# Altium schematic sheet [03] SOC.SchDoc: SOC
size A3; Organization: Blinkinlabs, LLC; DocumentNumber: 3; SheetNumber: 3; SheetTotal: 4
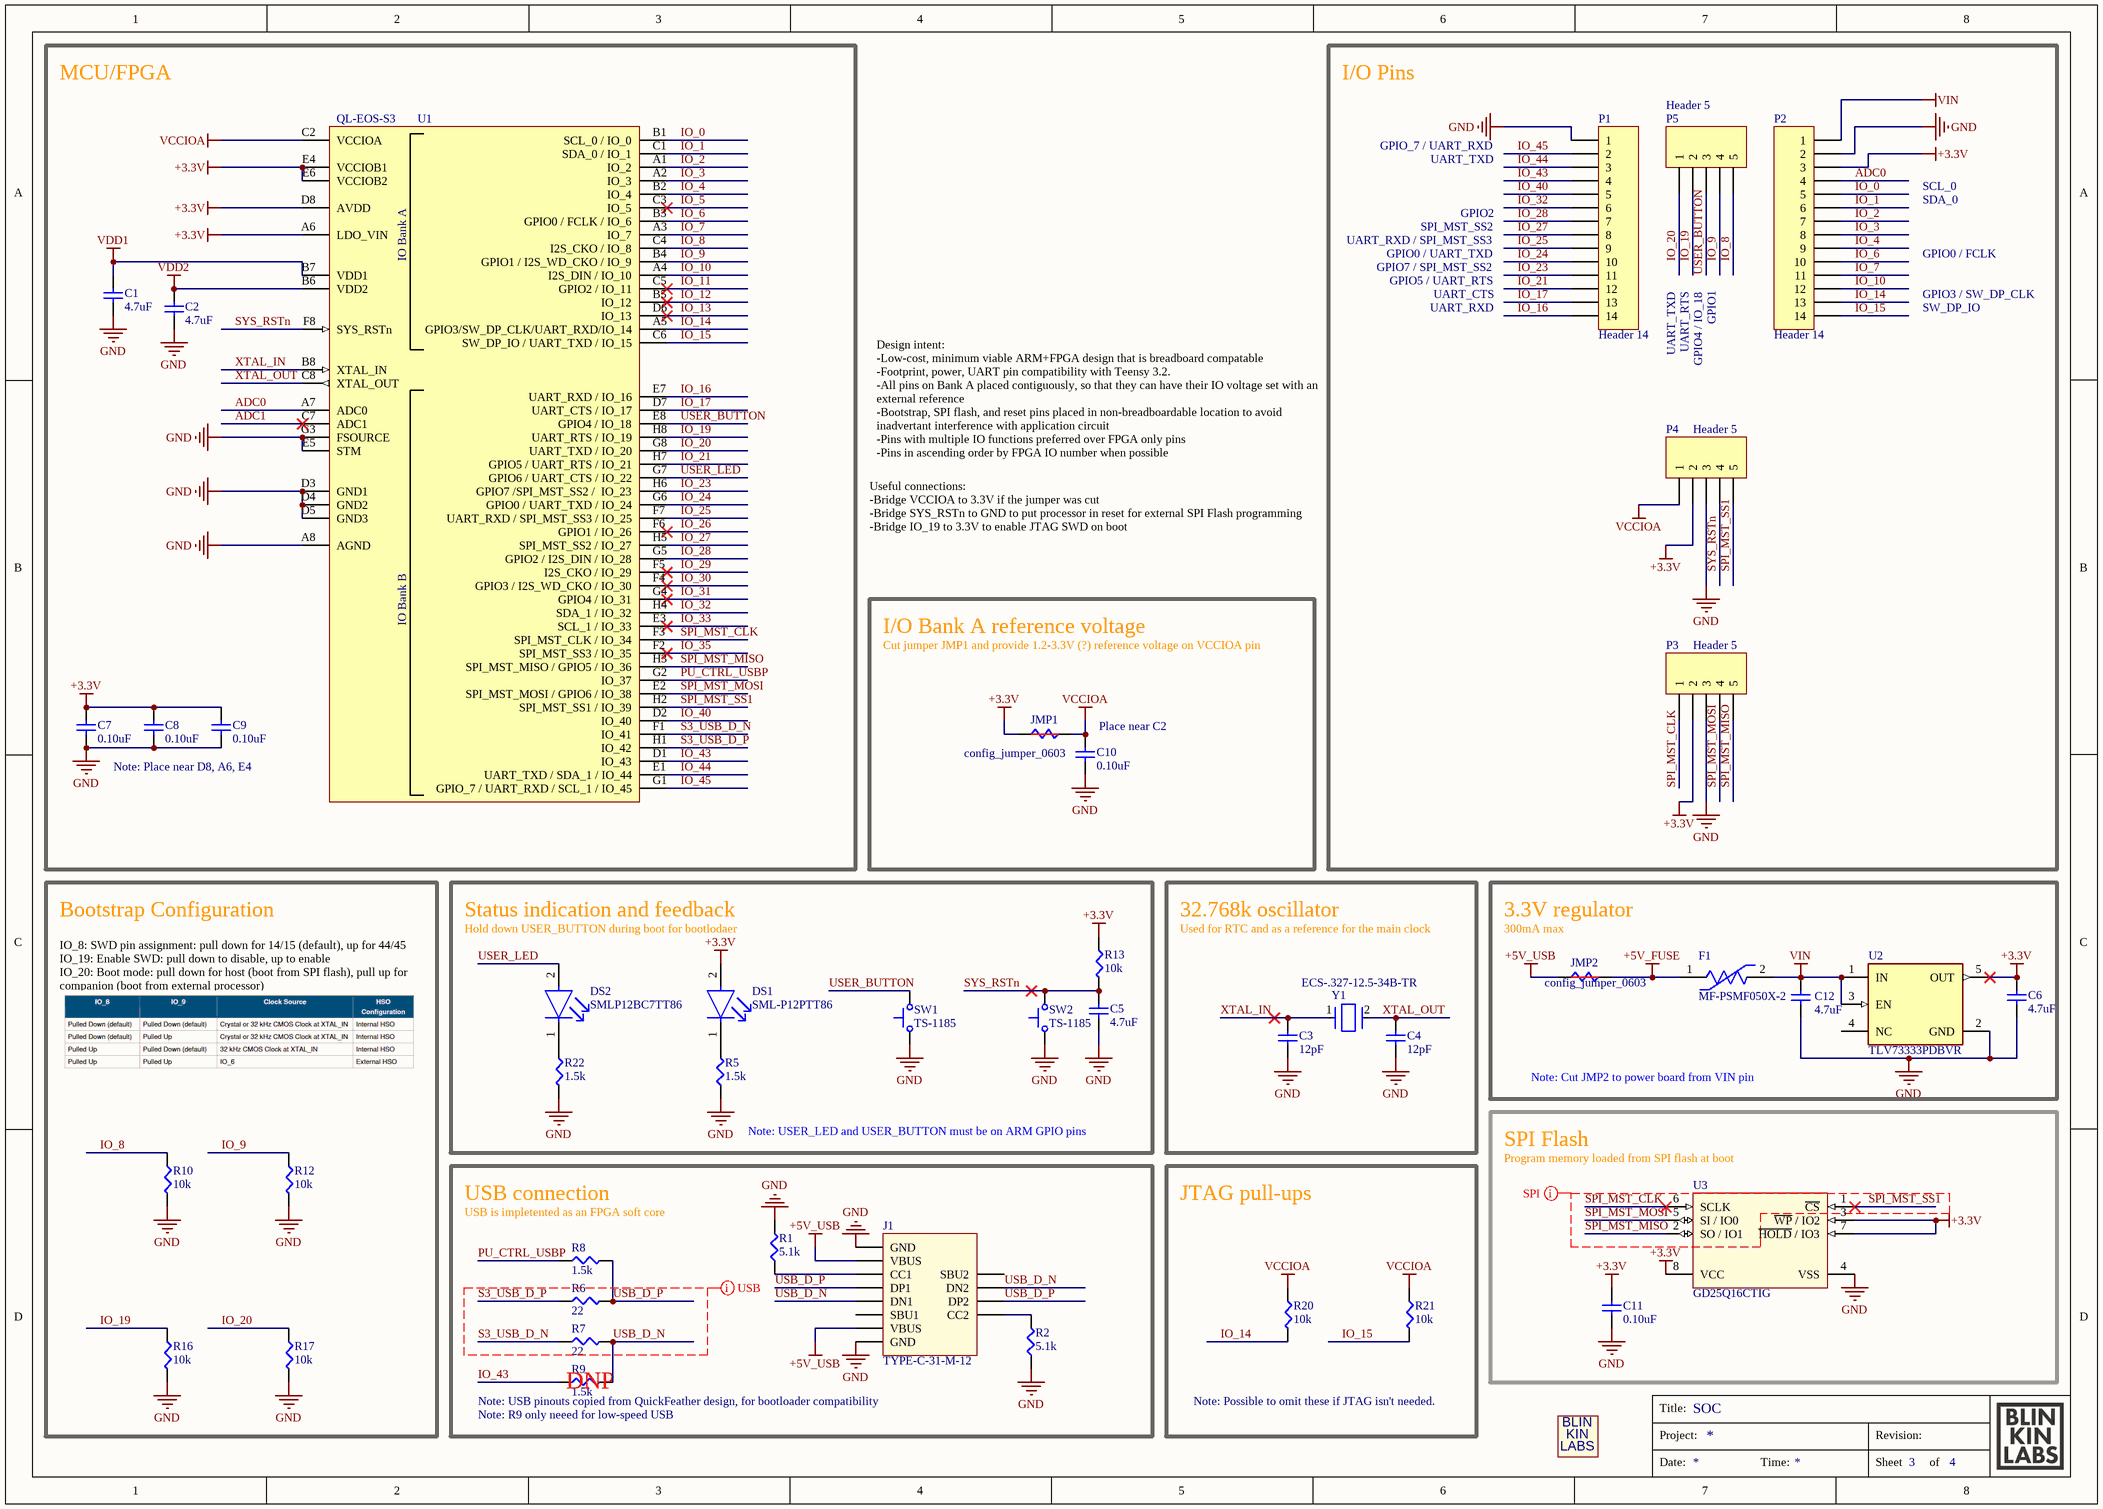
[diagram p0: [03] SOC.SchDoc]

## Parts
C1  4.7uF  [CAPC1005X06L]
C2  4.7uF  [CAPC1005X06L]
C3  12pF  [CAPC1005X06L]
C4  12pF  [CAPC1005X06L]
C5  4.7uF  [CAPC1005X06L]
C6  4.7uF  [CAPC1005X06L]
C7  0.10uF  [CAPC1005X06L]
C8  0.10uF  [CAPC1005X06L]
C9  0.10uF  [CAPC1005X06L]
C10  0.10uF  [CAPC1005X06L]
C11  0.10uF  [CAPC1005X06L]
C12  4.7uF  [CAPC1608X09L]
DS1  SML-P12PTT86  [FP-SML-P1-MFG]
DS2  SMLP12BC7TT86  [FP-SML-P12-MFG]
F1  MF-PSMF050X-2  [FP-MF-PSMF-MFG]
J1  TYPE-C-31-M-12  [TYPE-C-31-M-12]
JMP1  config_jumper_0603  [config_jumper_0603]  (no BOM)
JMP2  config_jumper_0603  [config_jumper_0603]  (no BOM)
L?  BLINKINLABS_LOGO  [BLINKINLABS_LOGO_SMALL]  (value not drawn)  (no BOM)
P1  Header 14  [HDR1X14]
P2  Header 14  [HDR1X14]
P3  Header 5  [HDR1X5]
P4  Header 5  [HDR1X5]
P5  Header 5  [HDR1X5]
R1  5.1k  [ERJ2G(0402)_L]
R2  5.1k  [ERJ2G(0402)_L]
R5  1.5k  [ERJ2G(0402)_L]
R6  22  [ERJ2G(0402)_L]
R7  22  [ERJ2G(0402)_L]
R8  1.5k  [ERJ2G(0402)_L]
R9  1.5k  [ERJ2G(0402)_L]
R10  10k  [ERJ2G(0402)_L]
R12  10k  [ERJ2G(0402)_L]
R13  10k  [ERJ2G(0402)_L]
R16  10k  [ERJ2G(0402)_L]
R17  10k  [ERJ2G(0402)_L]
R20  10k  [ERJ2G(0402)_L]
R21  10k  [ERJ2G(0402)_L]
R22  1.5k  [ERJ2G(0402)_L]
SW1  TS-1185  [TS-1185]
SW2  TS-1185  [TS-1185]
U1  QL-EOS-S3  [BGA64C40P8X8_350X350X80]
U2  TLV73333PDBVR  [FP-DBV0005A-MFG]
U3  GD25Q16CTIG  [SOP127P600X175-8N-2]
Y1  ECS-.327-12.5-34B-TR  [FP-ECX-31B-MFG]

## Blocks framed on the sheet
MCU/FPGA: C1 C2 C7-C9 U1
I/O Pins: P1-P5
I/O Bank A reference voltage: C10 JMP1
Bootstrap Configuration: R10 R12 R16 R17
Status indication and feedback: C5 DS1 DS2 R5 R13 R22 SW1 SW2
32.768k oscillator: C3 C4 Y1
3.3V regulator: C6 C12 F1 JMP2 U2
SPI Flash: C11 U3
DNP: J1 R1 R2 R6-R9
JTAG pull-ups: R20 R21

## Nets
+3.3V: C6.1 C7.2 C8.2 C9.2 C11.2 DS1.2(A) JMP1.1 P2.3 P3.2 P4.2 R13.1 U1.A6(LDO_VIN) U1.D8(AVDD) U1.E4(VCCIOB1) U1.E6(VCCIOB2) U2.5(OUT) U3.3(~{WP}_/_IO2) U3.7(~{HOLD}_/_IO3) U3.8(VCC)
+5V_FUSE: F1.1 JMP2.2
+5V_USB: J1.A4/B9(VBUS) J1.A9/B4(VBUS) JMP2.1
GND: C1.2 C2.2 C3.1 C4.1 C5.2 C6.2 C7.1 C8.1 C9.1 C10.1 C11.1 C12.2 J1.A1/B12(GND) J1.A12/B1(GND) P1.1 P2.2 P3.3 P4.3 R1.2 R2.1 R5.1 R10.2 R12.2 R16.2 R17.2 R22.2 SW1.1 SW2.1 U1.A8(AGND) U1.D3(GND1) U1.D4(GND2) U1.D5(GND3) U1.E5(STM) U1.G3(FSOURCE) U2.2(GND) U3.4(VSS)
VCCIOA: C10.2 JMP1.2 P4.1 R20.1 R21.1 U1.C2(VCCIOA)
VDD1: C1.1 U1.B7(VDD1)
VDD2: C2.1 U1.B6(VDD2)
VIN: C12.1 F1.2 P2.1 U2.1(IN) U2.3(EN)
ADC0: P2.4 U1.A7(ADC0)
ADC1: U1.C7(ADC1)
IO_0: P2.5 U1.B1(SCL_0_/_IO_0)
IO_1: P2.6 U1.C1(SDA_0_/_IO_1)
IO_2: P2.7 U1.A1(IO_2)
IO_3: P2.8 U1.A2(IO_3)
IO_4: P2.9 U1.B2(IO_4)
IO_5: U1.C3(IO_5)
IO_6: P2.10 U1.B3(GPIO0_/_FCLK_/_IO_6)
IO_7: P2.11 U1.A3(IO_7)
IO_8: P5.5 R10.1 U1.C4(I2S_CKO_/_IO_8)
IO_9: P5.4 R12.1 U1.B4(GPIO1_/_I2S_WD_CKO_/_IO_9)
IO_10: P2.12 U1.A4(I2S_DIN_/_IO_10)
IO_11: U1.C5(GPIO2_/_IO_11)
IO_12: U1.B5(IO_12)
IO_13: U1.D6(IO_13)
IO_14: P2.13 R20.2 U1.A5(GPIO3/SW_DP_CLK/UART_RXD/IO_14)
IO_15: P2.14 R21.2 U1.C6(SW_DP_IO_/_UART_TXD_/_IO_15)
IO_16: P1.14 U1.E7(UART_RXD_/_IO_16)
IO_17: P1.13 U1.D7(UART_CTS_/_IO_17)
IO_19: P5.2 R16.1 U1.H8(UART_RTS_/_IO_19)
IO_20: P5.1 R17.1 U1.G8(UART_TXD_/_IO_20)
IO_21: P1.12 U1.H7(GPIO5_/_UART_RTS_/_IO_21)
IO_23: P1.11 U1.H6(GPIO7_/SPI_MST_SS2_/__IO_23)
IO_24: P1.10 U1.G6(GPIO0_/_UART_TXD_/_IO_24)
IO_25: P1.9 U1.F7(UART_RXD_/_SPI_MST_SS3_/_IO_25)
IO_26: U1.F6(GPIO1_/_IO_26)
IO_27: P1.8 U1.H5(SPI_MST_SS2_/_IO_27)
IO_28: P1.7 U1.G5(GPIO2_/_I2S_DIN_/_IO_28)
IO_29: U1.F5(I2S_CKO_/_IO_29)
IO_30: U1.F4(GPIO3_/_I2S_WD_CKO_/_IO_30)
IO_31: U1.G4(GPIO4_/_IO_31)
IO_32: P1.6 U1.H4(SDA_1_/_IO_32)
IO_33: U1.E3(SCL_1_/_IO_33)
IO_35: U1.F2(SPI_MST_SS3_/_IO_35)
IO_40: P1.5 U1.D2(IO_40)
IO_43: P1.4 R9.1 U1.D1(IO_43)
IO_44: P1.3 U1.E1(UART_TXD_/_SDA_1_/_IO_44)
IO_45: P1.2 U1.G1(GPIO_7_/_UART_RXD_/_SCL_1_/_IO_45)
PU_CTRL_USBP: R8.1 U1.G2(IO_37)
S3_USB_D_N: R7.1 U1.F1(IO_41)
S3_USB_D_P: R6.1 U1.H1(IO_42)
SPI_MST_CLK: P3.1 U1.F3(SPI_MST_CLK_/_IO_34) U3.6(SCLK)
SPI_MST_MISO: P3.5 U1.H3(SPI_MST_MISO_/_GPIO5_/_IO_36) U3.2(SO_/_IO1)
SPI_MST_MOSI: P3.4 U1.E2(SPI_MST_MOSI_/_GPIO6_/_IO_38) U3.5(SI_/_IO0)
SPI_MST_SS1: P4.5 U1.H2(SPI_MST_SS1_/_IO_39) U3.1(~{CS})
SYS_RSTn: C5.1 P4.4 R13.2 SW2.2 U1.F8(SYS_RSTn)
USB_D_N: J1.A7(DN1) J1.B7(DN2) R7.2 R9.2
USB_D_P: J1.A6(DP1) J1.B6(DP2) R6.2 R8.2
USER_BUTTON: P5.3 SW1.2 U1.E8(GPIO4_/_IO_18)
USER_LED: DS2.2(A) U1.G7(GPIO6_/_UART_CTS_/_IO_22)
XTAL_IN: C3.2 U1.B8(XTAL_IN) Y1.1(In/Out)
XTAL_OUT: C4.2 U1.C8(XTAL_OUT) Y1.2(Out/In)
NetDS1_1: DS1.1(C) R5.2
NetDS2_1: DS2.1(C) R22.1
NetJ1_A5: J1.A5(CC1) R1.1
NetJ1_B5: J1.B5(CC2) R2.2

Not connected (* = marked no-connect by the designer): J1 A8(SBU1) B8(SBU2); U2 4(NC)

## Layout directives
net class SPI: SPI_MST_CLK, SPI_MST_MISO, SPI_MST_MOSI, SPI_MST_SS1
net class USB: S3_USB_D_N, S3_USB_D_P, USB_D_N, USB_D_P

## Notes on the sheet
- GPIO_7 / UART_RXD
- UART_TXD
- UART_RXD / SPI_MST_SS3
- SPI_MST_SS2
- GPIO2
- SDA_0
- SCL_0
- GPIO7 / SPI_MST_SS2
- GPIO0 / UART_TXD
- GPIO5 / UART_RTS
- UART_RXD
- UART_CTS
- GPIO0 / FCLK
- GPIO3 / SW_DP_CLK
- SW_DP_IO
- UART_RTS
- GPIO4 / IO_18
- GPIO1
- Design intent:
  -Low-cost, minimum viable ARM+FPGA design that is breadboard compatable
  -Footprint, power, UART pin compatibility with Teensy 3.2.
  -All pins on Bank A placed contiguously, so that they can have their IO voltage set with an external reference
  -Bootstrap, SPI flash, and reset pins placed in non-breadboardable location to avoid inadvertant interference with application circuit
  -Pins with multiple IO functions preferred over FPGA only pins
  -Pins in ascending order by FPGA IO number when possible
- Useful connections:
  -Bridge VCCIOA to 3.3V if the jumper was cut
  -Bridge SYS_RSTn to GND to put processor in reset for external SPI Flash programming
  -Bridge IO_19 to 3.3V to enable JTAG SWD on boot
- Cut jumper JMP1 and provide 1.2-3.3V (?) reference voltage on VCCIOA pin
- Note: Place near D8, A6, E4
- (near C10) Place near C2
- Hold down USER_BUTTON during boot for bootlodaer
- Used for RTC and as a reference for the main clock
- (near JMP2) 300mA max
- IO_8: SWD pin assignment: pull down for 14/15 (default), up for 44/45
  IO_19: Enable SWD: pull down to disable, up to enable
  IO_20: Boot mode: pull down for host (boot from SPI flash), pull up for companion (boot from external processor)
- Note: Cut JMP2 to power board from VIN pin
- (near R5) Note: USER_LED and USER_BUTTON must be on ARM GPIO pins
- (near U3) Program memory loaded from SPI flash at boot
- USB connection
- (near R8) USB is impletented as an FPGA soft core
- (near R9) Note: USB pinouts copied from QuickFeather design, for bootloader compatibility
- (near R9) Note: R9 only neeed for low-speed USB
- Note: Possible to omit these if JTAG isn't needed.
- Title:
- Project:
- Revision:
- Date:
- Time:
- Sheet
- of
- (in symbol BLINKINLABS_LOGO) BLIN; KIN; LABS
- (in symbol QL-EOS-S3) IO Bank A; IO Bank B

## Library data of the parts
C1 C2 C5 C6 = GRM155R60J475ME47D: CAP CER 4.7UF 6.3V X5R 0402; Manufacturer: Murata Electronics North America; Tolerance: ±20%; PartNumber: GRM155R60J475ME47D; Datasheets: http://www.murata.com/~/media/webrenewal/support/library/catalog/products/capacitor/mlcc/c02e.pdf; Image: //media.digikey.com/Renders/Murata%20Renders/ZRB-SERIES-0402.jpg; Digi-Key Part Number: 490-5915-1-ND; Packaging: Cut Tape (CT); Series: GRM; Value: 4.7uF; Voltage: 6.3V; Temperature Coefficient: X5R; Operating Temperature: -55°C ~ 85°C; Features: Derating Recommended; Applications: General Purpose; Package / Case: 0402 (1005 Metric); Case/Package: 0402
C3 C4 = GRM1555C1E120GA01D: CAP CER 12PF 25V NP0 0402; Manufacturer: Murata Electronics North America; Tolerance: ±2%; Temperature Coefficient: C0G, NP0; PartNumber: GRM1555C1E120GA01D; Datasheets: http://www.murata.com/~/media/webrenewal/support/library/catalog/products/capacitor/mlcc/c02e.pdf; Image: //media.digikey.com/Renders/Murata%20Renders/ZRB-SERIES-0402.jpg; Digi-Key Part Number: 490-8169-1-ND; Packaging: Cut Tape (CT); Series: GRM; Value: 12pF; Voltage: 25V; Operating Temperature: -55°C ~ 125°C; Features: -; Applications: General Purpose; Package / Case: 0402 (1005 Metric); Case/Package: 0402
C7-C11 = GRM152R61A104ME19D: CAP CER 0.1UF 10V X5R 0402; Manufacturer: Murata Electronics North America; Tolerance: ±20%; Datasheets: http://www.murata.com/~/media/webrenewal/support/library/catalog/products/capacitor/mlcc/c02e.pdf; Image: //media.digikey.com/Renders/Murata%20Renders/ZRB-SERIES-0402.jpg; Digi-Key Part Number: 490-10009-1-ND; Packaging: Cut Tape (CT); Series: GRM; Value: 0.10uF; Voltage: 10V; Temperature Coefficient: X5R; Operating Temperature: -55°C ~ 85°C; Features: Derating Recommended; Applications: General Purpose; Package / Case: 0402 (1005 Metric); Case/Package: 0402; PartNumber: GRM152R61A104ME19D
C12 = GRM188R61A475KE15D: CAP CER 4.7UF 10V X5R 0603; Manufacturer: Murata Electronics North America; Tolerance: ±10%; PartNumber: GRM188R61A475KE15D; Datasheets: http://www.murata.com/~/media/webrenewal/support/library/catalog/products/capacitor/mlcc/c02e.pdf; Image: //media.digikey.com/Renders/Murata%20Renders/ZRB-SERIES-0402.jpg; Digi-Key Part Number: 490-10477-1-ND; Series: GRM; Value: 4.7uF; Voltage: 10V; Temperature Coefficient: X5R; Operating Temperature: -55°C ~ 85°C; Features: Derating Recommended; Applications: General Purpose; Package / Case: 0603 (1608 Metric); Case/Package: 0603
DS1 = CMP-08952-000020-1: LED GREEN CLEAR 1006 SMD; Manufacturer: Rohm; Led Orientation: Top View; Wavelength: 560nm; Forward Current: 20mA; Reverse Voltage: 5V; Power Dissipation: 52mW; Forward Voltage: 2.1V; Luminous Intensity: 10mcd; Device Class L1: Optoelectronics; Digikey Description: LED GREEN CLEAR 1006 SMD; Lead Free: Yes; Manufacturer Part Number: SML-P12PTT86; Temperature Range High: +85°C; Octopart: https://octopart.com/sml-p12ptt86-rohm-9290705; Device Class L2: LEDs; Colour: Green; RoHS: TRUE; Height: 0.25mm; Automotive: No; Device Class L3: unset; Temperature Range Low: -40°C; ComponentLink2Description: Datasheet; Mouser Description: Standard LEDs - SMD SMD Green 13 mcd height=0.2; Category: Diode; ComponentLink2URL: https://www.rohm.com/datasheet/SML-P12DT(R); Temperature: -40°C to +85°C; Package: SML-P1
DS2 = CMP-08952-000025-1: LED BLUE CLEAR 1006 SMD; Manufacturer: Rohm; Led Orientation: Top View; Reverse Voltage: 5V; Wavelength: 470nm; Luminous Intensity: 17mcd; Power Dissipation: 66mW; Forward Voltage: 2.9V; Forward Current: 5mA; ComponentLink2URL: https://media.digikey.com/pdf/Data%20Sheets/Rohm%20PDFs/SML-P1_Series_RevB.pdf; ComponentLink2Description: Datasheet; Colour: Blue; RoHS: TRUE; Package: SML-P12; Device Class L1: Optoelectronics; Manufacturer Part Number: SMLP12BC7TT86; Automotive: No; Temperature Range Low: -40°C; Temperature: -40°C to +85°C; Height: 0.25mm; Octopart: https://octopart.com/smlp12bc7tt86-rohm-9290887; Digikey Description: LED BLUE CLEAR 1006 SMD; Lead Free: Yes; Device Class L2: LEDs; Category: Diode; Device Class L3: unset; Mouser Description: ROHM SMLP12BC7TT86, SML-P12 PICOLED Series Blue LED, 1006(0402), Rectangle Lens; Temperature Range High: +85°C
F1 = CMP-07400-000013-1: PTC RESET FUSE 6V 500MA 0805; Manufacturer: Bourns Inc.; Trip Current: 1A; Trip Time: 0.1s; Value: 0.15-0.9Ω; Hold Current: 0.5A; Current Rating: 40A; Category: Fuse; Temperature: -40°C to +85°C; ComponentLink2Description: Datasheet; Manufacturer Part Number: MF-PSMF050X-2; Temperature Range High: +85°C; Package: MF-PSMF; Device Class L1: Circuit Protection; Lead Free: Yes; ComponentLink2URL: https://www.bourns.com/docs/product-datasheets/mfpsmf.pdf?sfvrsn=9c05cafe_24; Ambient Temperature Range Low: -40°C; Mouser Description: Resettable Fuses - PPTC .50A 6V 0.15ohm Hold .5 Trip 1; Resistance: 0.15-0.9Ω; Automotive: Yes; Ambient Temperature Range High: +85°C; Device Class L2: PTC Resettable Fuses; Temperature Range Low: -40°C; Device Class L3: unset; Octopart: https://octopart.com/mf-psmf050x-2-bourns-7483438; Digikey Description: PTC RESET FUSE 6V 500MA 0805; Height: 0.85mm; RoHS: TRUE; Voltage Rating: 6V
J1 = TYPE-C-31-M-12: USB Connector TYPE-C-31-M-12 Female 16P SMD; Manufacturer: HRO; PartNumber: TYPE-C-31-M-12
JMP1 JMP2 = config_jumper_0603: Shorted-by-default jumper, with 0603 pad
L? = BLINKINLABS_LOGO: Square logo
P1 P2 = Header 14: Header, 14-Pin; LatestRevisionDate: 17-Jul-2002; LatestRevisionNote: Re-released for DXP Platform.; Publisher: Altium Limited
P3-P5 = Header 5: Header, 5-Pin; LatestRevisionDate: 17-Jul-2002; LatestRevisionNote: Re-released for DXP Platform.; Publisher: Altium Limited
R1 R2 = ERJ-2GEJ512X: RES SMD 5.1K OHM 5% 1/10W 0402; Manufacturer: Panasonic Electronic Components; Power (Watts): 0.1W, 1/10W; Temperature Coefficient: ±200ppm/°C; PartNumber: ERJ-2GEJ512X; Datasheets: http://industrial.panasonic.com/www-cgi/jvcr13pz.cgi?E+PZ+3+AOA0001+ERJ2GEJ512X+7+WW; Image: //media.digikey.com/Photos/Panasonic%20Photos/ERJ-PA2-Series.jpg; Digi-Key Part Number: P5.1KJCT-ND; Series: ERJ; Value: 5.1k; Tolerance: ±5%; Composition: Thick Film; Features: Automotive AEC-Q200; Operating Temperature: -55°C ~ 155°C; Package / Case: 0402 (1005 Metric); Case/Package: 0402; Size / Dimension: 0.039" L x 0.020" W (1.00mm x 0.50mm); Height - Seated (Max): 0.016" (0.40mm); Number of Terminations: 2
R5 R8 R9 R22 = ERJ-2GEJ152X: RES SMD 1.5K OHM 5% 1/10W 0402; Manufacturer: Panasonic Electronic Components; Power (Watts): 0.1W, 1/10W; Temperature Coefficient: ±200ppm/°C; PartNumber: ERJ-2GEJ152X; Datasheets: http://industrial.panasonic.com/www-cgi/jvcr13pz.cgi?E+PZ+3+AOA0001+ERJ2GEJ152X+7+WW; Image: //media.digikey.com/Photos/Panasonic%20Photos/ERJ-PA2-Series.jpg; Digi-Key Part Number: P1.5KJCT-ND; Series: ERJ; Value: 1.5k; Tolerance: ±5%; Composition: Thick Film; Features: Automotive AEC-Q200; Operating Temperature: -55°C ~ 155°C; Package / Case: 0402 (1005 Metric); Case/Package: 0402; Size / Dimension: 0.039" L x 0.020" W (1.00mm x 0.50mm); Height - Seated (Max): 0.016" (0.40mm); Number of Terminations: 2
R6 R7 = ERJ-2GEJ220X: RES SMD 22 OHM 5% 1/10W 0402; Manufacturer: Panasonic Electronic Components; Power (Watts): 0.1W, 1/10W; Temperature Coefficient: ±200ppm/°C; PartNumber: ERJ-2GEJ220X; Datasheets: http://industrial.panasonic.com/www-cgi/jvcr13pz.cgi?E+PZ+3+AOA0001+ERJ2GEJ220X+7+WW; Image: //media.digikey.com/Photos/Panasonic%20Photos/ERJ-PA2-Series.jpg; Digi-Key Part Number: P22JCT-ND; Series: ERJ; Value: 22; Tolerance: ±5%; Composition: Thick Film; Features: Automotive AEC-Q200; Operating Temperature: -55°C ~ 155°C; Package / Case: 0402 (1005 Metric); Case/Package: 0402; Size / Dimension: 0.039" L x 0.020" W (1.00mm x 0.50mm); Height - Seated (Max): 0.016" (0.40mm); Number of Terminations: 2
R10 R12 R13 R16 R17 R20 R21 = ERJ-2GEJ103X: RES SMD 10K OHM 5% 1/10W 0402; Manufacturer: Panasonic Electronic Components; Factory Stock: 0; Unit Price (USD): 0.00350; @ qty: 1500; Minimum Quantity: 1; Power (Watts): 0.1W, 1/10W; Temperature Coefficient: ±200ppm/°C; Part Number: ERJ-2GEJ103X; Datasheets: http://industrial.panasonic.com/www-cgi/jvcr13pz.cgi?E+PZ+3+AOA0001+ERJ2GEJ103X+7+WW; Image: //media.digikey.com/Photos/Panasonic%20Photos/ERJ-PA2-Series.jpg; Digi-Key Part Number: P10KJCT-ND; Quantity Available: 2560215; Packaging: Cut Tape (CT); Series: ERJ; Part Status: Active; Value: 10k; Tolerance: ±5%; Composition: Thick Film; Features: Automotive AEC-Q200; Operating Temperature: -55°C ~ 155°C; Package / Case: 0402 (1005 Metric); Size / Dimension: 0.039" L x 0.020" W (1.00mm x 0.50mm); Height - Seated (Max): 0.016" (0.40mm); Number of Terminations: 2; Failure Rate: -; Case/Package: 0402; PartNumber: ERJ-2GEJ103X
SW1 SW2 = TS-1185: Tact Switch, 3x4mm, no alignment pin, turtle style; Manufacturer: XKB; PartNumber: TS-1185
U1 = QL-EOS-S3: QuickLogicEOS S3 Ultra Low Power multicore MCU; Manufacturer: QuickLogic Corporation; PartNumber: QL-EOS-S3
U2 = CMP-04917-000053-1: IC REG LINEAR 3.3V 300MA SOT23-5; Manufacturer: Texas Instruments; Max Junction Temp: +125°C; Accuracy Percentage: 1%; Min Supply Voltage: 1.4V; Number Of Outputs: 1; Dropout Voltage: 125mV; Nominal Supply Current: 34uA; Max Supply Voltage: 5.5V; Output Type: Fixed; Standoff Height: 0mm; Digikey Description: IC REG LINEAR 3.3V 300MA SOT23-5; Manufacturer Part Number: TLV73333PDBVR; Temperature Range High: +125°C; Temperature: -40°C to +125°C; Output Current: 300mA; Mouser Description: LDO Voltage Regulators Capacitr-Free 300-mA 5-SOT-23 -40 to 125; Automotive: No; Height: 1.45mm; Device Class L3: Voltage Regulators - Linear; ComponentLink2Description: Datasheet; Device Class L1: Integrated Circuits (ICs); ComponentLink2URL: http://www.ti.com/lit/ds/symlink/tlv733p.pdf; Octopart: https://octopart.com/tlv73333pdbvr-texas+instruments-51080890; Temperature Range Low: -40°C; RoHS: TRUE; Lead Free: Yes; Output Voltage: 3.3V; Package: DBV0005A; Device Class L2: Power Management ICs; Category: IC
U3 = GD25Q16CTIG: 16M-bit Serial Flash, 256 Bytes per programmable page, standard, dual, quad SPI; Manufacturer: Gigadevice; PartNumber: GD25Q16CTIG
Y1 = CMP-40224-000020-1: CRYSTAL 32.7680KHZ 12.5PF SMD; Frequency Tolerance: 20ppm; Frequency: 32.768kHz; ESR (Equivalent Series Resistance): 70kR; Max Operating Temperature: 85°C; Height: 0.035inch; Number of Pins: 2; Width: 0.059inch; Package Quantity: 3000; Length: 0.126inch; Min Operating Temperature: -40°C; Load Capacitance: 12.5pF; Mount: Surface Mount; Case/Package: SMD/SMT; Termination: SMD/SMT; Packaging: Tape and Reel